# EAGLE schematic class b (EAGLE 9.6.2)
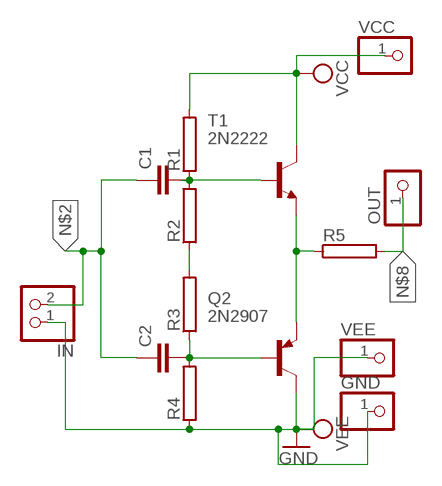
[diagram p0: schematic, sheet 1]

## Parts
C1  C2,5-3  [C2.5-3]
C2  C2,5-3  [C2.5-3]
GND  PINHD-1X1  [1X01]
IN  PINHD-1X2  [1X02]
OUT  PINHD-1X1  [1X01]
Q2  2N2907  [TO18]
R1  RAC01  [AC01]
R2  RAC01  [AC01]
R3  RAC01  [AC01]
R4  RAC01  [AC01]
R5  RAC01  [AC01]
T1  2N2222  [TO18]
VCC  PINHD-1X1  [1X01]
VEE  PINHD-1X1  [1X01]

## Nets
N$1: R2.1 R3.2
N$2: C1.1 C2.1 IN.2
N$3: C1.2 R1.1 R2.2 T1.2(B)
N$4: C2.2 Q2.2(B) R3.1 R4.2
N$7: Q2.1(E) R5.1 T1.1(E)
N$8: OUT.1 R5.2
VCC: R1.2 T1.3(C) VCC.1
VEE: GND.1 IN.1 Q2.3(C) R4.1 VEE.1 ; supply symbol labelled GND

## Library data of the parts
C1 C2 = capacitor-wima:C: CAPACITOR naming: grid - package width
GND OUT VCC VEE = pinhead:PINHD-1X1: PIN HEADER
IN = pinhead:PINHD-1X2: PIN HEADER
Q2 = transistor-pnp:2N2907*: PNP Transistor
R1-R5 = resistor-power:R: Power Resitor; OC_FARNELL: unknown; OC_NEWARK: unknown
T1 = transistor:2N2222: NPN TRANSISTOR